# Altium schematic sheet GPS.SchDoc
size A4; SheetNumber: 3; SheetTotal: 7
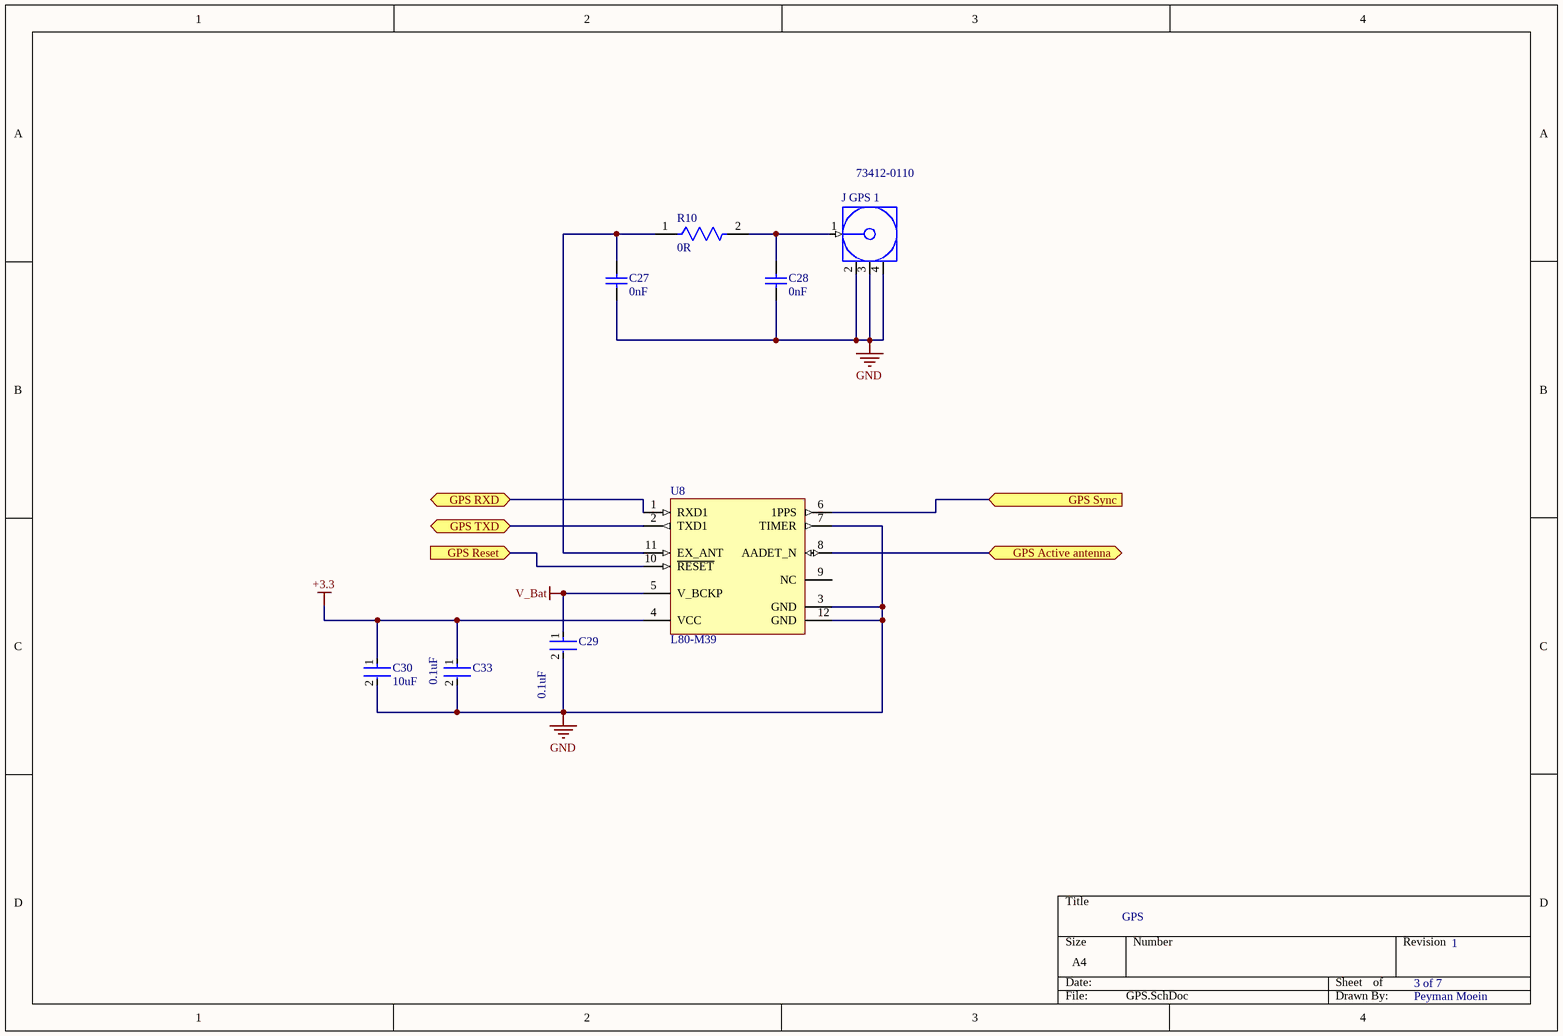
[diagram p0: GPS.SchDoc]

## Parts
C27  0nF  [CAPC2013X70X45NL10T25]
C28  0nF  [CAPC2013X70X45NL10T25]
C29  0.1uF  [FP-C0805C-DN-MFG]
C30  10uF  [FP-GRM21B-0_1-IPC_C]
C33  0.1uF  [FP-C0805C-DN-MFG]
J_GPS_1  73412-0110  [MOLX-73412-0110_V]
R10  0R  [FP-CRCW0805-e3-MFG]
U8  L80-M39  [QUEC-L80-M39-12_V]

## Ports
GPS Active antenna (bidir), GPS Reset (in), GPS RXD (bidir), GPS Sync (in), GPS TXD (bidir)

## Nets
+3.3: C30.1 C33.1 U8.4(VCC)
GND: C27.1 C28.1 C29.2 C30.2 C33.2 J_GPS_1.2(GND) J_GPS_1.3(GND) J_GPS_1.4(GND) U8.3(GND) U8.7(TIMER) U8.12(GND)
V_Bat: C29.1 U8.5(V_BCKP)
GPS Active antenna: U8.8(AADET_N) ; port GPS Active antenna
GPS Reset: U8.10(~{RESET}) ; port GPS Reset
GPS RXD: U8.1(RXD1) ; port GPS RXD
GPS Sync: U8.6(1PPS) ; port GPS Sync
GPS TXD: U8.2(TXD1) ; port GPS TXD
NetC27_2: C27.2 R10.1 U8.11(EX_ANT)
NetC28_2: C28.2 J_GPS_1.1(SIGNAL) R10.2

Not connected (* = marked no-connect by the designer): U8 9(NC)

## Notes on the sheet
- GPS
- 3 of 7
- 1
- Peyman Moein

## Library data of the parts
C27 C28 = CMP-2007-00866-1: Part Number: GRM2165C1H102JA01D; Manufacturer: Murata
C29 C33 = CMP-2100-03606-3: C49678; Manufacturer Part Number: CC0805KRX7R9BB104; Manufacturer: Yageo; Tolerance: 0.1; Capacitance: 100 nF; Value: 100 nF; Temperature Characteristic: X7R; Voltage Rating: 50 V; Material: Ceramic; Device Class L1: Passive Components; ComponentLink2Description: Datasheet; Package: CC0805-0.85; Digikey Description: CAP CER 0.1UF 50V X7R 0805; Device Class L3: Ceramic Capacitors; Temperature: -30°C to +85°C; Height: 0.95mm; RoHS: TRUE; Ipc Land Pattern Name: CAPC200125X85; Device Class L2: Capacitors; Category: Cap; Temperature Range Low: -30°C; Temperature Range High: +85°C; Mouser Description: Multilayer Ceramic Capacitors MLCC - SMD/SMT 100nF 50V X7R 10%; Footprint Url: http://www.yageo.com/exep/pages/download/literatures/UPY-C_GEN_24.pdf; Automotive: No; Octopart: https://octopart.com/cc0805krx7r9bb104-yageo-192993; Lead Free: Yes; ComponentLink2URL: http://www.yageo.com/documents/recent/UPY-GPHC_Y5V_6.3V-to-50V_8.pdf
C30 = CMP-2007-03453-2: C77075; Voltage Rating (DC): 16V; Dielectric: X5R; Tolerance: 10%; Material: Ceramic; Radiation Hardening: No; Thickness: 0.053inch; Lead Free: Lead Free; Package Quantity: 1; Width: 1.25mm; Case Code (Imperial): 0805; Depth: 1.25mm; Packaging: Tape and Reel; Max Operating Temperature: 85°C; Voltage Rating: 16V; Voltage: 16V; Capacitance: 10uF; Height: 1.25mm; Case Code (Metric): 2012; Mount: Surface Mount; Case/Package: 0805; REACH SVHC: No SVHC; Length: 2mm; Min Operating Temperature: -55°C; Termination: SMD/SMT
J_GPS_1 = CMP-1676-00003-1: C411563; Voltage Rating (AC): 60 V; Mating Cycles: 30; Impedance: 50 Ohm; Frequency: 6 Hz; Gender: Female; RoHSCompliant: true; Length: 3 mm; DatasheetVersion: 04/2016; ComponentLink3URL: http://www.molex.com/pdm_docs/sd/734120110_sd.pdf; Max Operating Temperature: 90 degC; Contact Material: Bronze; Mount: Surface Mount; ComponentLink2Description: Datasheet; Packaging: Tape and Reel; Radiation Hardening: No; Voltage Rating: 60 V; Mounting Technology: Surface Mount; ComponentLink1Description: Manufacturer URL; ComponentLink1URL: http://www.molex.com/; Width: 3 mm; ComponentLink3Description: Package Specification; Package Quantity: 5000; PackageReference: 73412-0110; Min Operating Temperature: -40 degC; Height: 1.25 mm; REACH SVHC: Unknown; ComponentLink2URL: http://www.molex.com/webdocs/datasheets/pdf/en-us/0734120110_RF_COAX_CONNECTORS.pdf; Contact Plating: Gold; PackageDescription: 4-Leads SMD, Body 2.6 x 2.6 mm; PackageVersion: Rev. C14, 07/2015
R10 = CMP-02407-004193-1: C25275; Tolerance: 1%; Resistance: 2.94R; Max Power Dissipation: 125mW; Temperature Coefficient: 100ppm/°C; Voltage Rating: 150V; Case/Package: 0805; Radiation Hardening: No; Width: 0.049inch; Packaging: Tape and Reel; Height: 0.02inch; Case Code (Imperial): 0805; Length: 2mm; Termination: SMD/SMT; Lead Free: Lead Free; Weight: 0.000194oz; Features: Automotive AEC-Q200; Min Operating Temperature: -55°C; Case Code (Metric): 2012; Contact Plating: Tin; Composition: Thick Film; Military Standard: Not; Number of Terminations: 2; Depth: 1.25mm; Package Quantity: 10; Max Operating Temperature: 155°C; Power Rating: 125mW
U8 = CMP-2000-05325-1: C133488; Manufacturer: Quectel; Maximum Operating Supply Voltage: 4.3V; Maximum Operating Frequency: 1575.42MHz; Screening Level: ExtendedIndustrial; Typical Operating Supply Voltage: 3.3V; Minimum Operating Supply Voltage: 3V; Manufacturer URL: http://www.quectel.com/; Mounting: SurfaceMount; Datasheet Version: Rev. V1.1, 08/2013; Datasheet URL: http://www.quectel.com/uploadimage/downlad/l80_hardware_design_v1.1.pdf